# Altium schematic sheet Sheet1.SchDoc
size A4
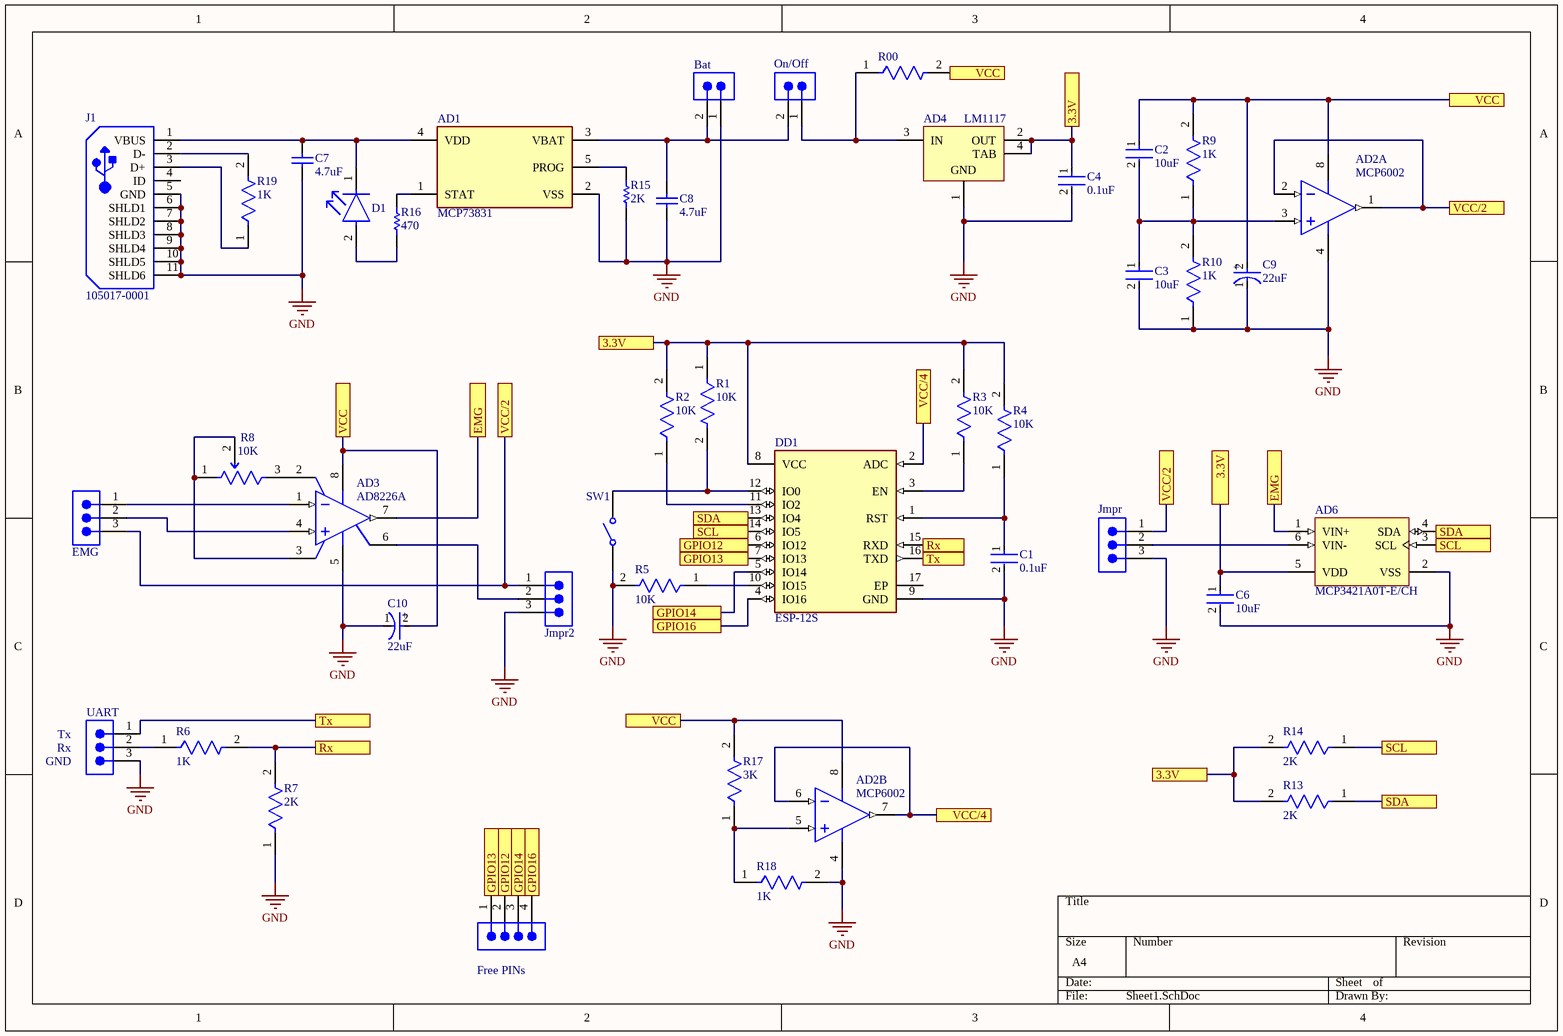
[diagram p0: Sheet1.SchDoc]

## Parts
AD1  MCP73831  [FP-C04-091-OT-IPC_B]
AD2  MCP6002  [SOIC-SN8_M]  (parts A,B of 2)
AD3  AD8226A  [ADI-RM-8_L]
AD4  LM1117  [DCY0004A_L]
AD6  MCP3421A0T-E/CH  [SOT-23-CH6_M]
Bat  TSW-102-26-G-S  [SMTC-TSW-102-26-XX-S]  (value not drawn)
C1  0.1uF  [FP-0805-L_2_0_0_1-W_1_25-IPC_C]
C2  10uF  [FP-0805-L_2_0_0_1-W_1_25-IPC_C]
C3  10uF  [FP-0805-L_2_0_0_1-W_1_25-IPC_C]
C4  0.1uF  [FP-0805-L_2_0_0_1-W_1_25-IPC_C]
C6  10uF  [FP-0805-L_2_0_0_1-W_1_25-IPC_C]
C7  4.7uF  [CAPC2013X145X50LL20T20]
C8  4.7uF  [CAPC2013X145X50LL20T20]
C9  22uF  [FP-NLJP-MFG]
C10  22uF  [FP-NLJP-MFG]
D1  LTST-C190GKT  [FP-LTST-C190GKT-MFG]  (value not drawn)
DD1  ESP-12S  [FP-ESP-12S-MFG]
EMG  TSW-103-07-T-S  [SMTC-TSW-103-07-X-S]  (value not drawn)
Free_PINs  TSW-104-08-L-S  [SMTC-TSW-104-08-X-S]  (value not drawn)
J1  105017-0001  [USB-MICRO-B_V]
Jmpr  TSW-103-07-T-S  [SMTC-TSW-103-07-X-S]  (value not drawn)
Jmpr2  TSW-103-07-T-S  [SMTC-TSW-103-07-X-S]  (value not drawn)
On/Off  TSW-102-26-G-S  [SMTC-TSW-102-26-XX-S]  (value not drawn)
R00  RP73D2B10RBTG  [FP-RP732B-MFG]  (value not drawn)
R1  10K  [FP-RG2012-IPC_C]
R2  10K  [FP-RG2012-IPC_C]
R3  10K  [FP-RG2012-IPC_C]
R4  10K  [FP-RG2012-IPC_C]
R5  10K  [FP-RG2012-IPC_C]
R6  1K  [FP-RG2012-IPC_C]
R7  2K  [FP-RG2012-IPC_C]
R8  10K  [FP-TC33X-2-MFG]
R9  1K  [FP-RG2012-IPC_C]
R10  1K  [FP-RG2012-IPC_C]
R13  2K  [FP-RG2012-IPC_C]
R14  2K  [FP-RG2012-IPC_C]
R15  2K  [RESC2013X60X30ML20T20]
R16  470  [RESC2013X60X30ML20T20]
R17  3K  [FP-RG2012-IPC_C]
R18  1K  [FP-RG2012-IPC_C]
R19  1K  [FP-RG2012-IPC_C]
SW1  434111050826  [434111050826]  (value not drawn)
UART  TSW-103-07-T-S  [SMTC-TSW-103-07-X-S]  (value not drawn)

## Ports
3.3V, EMG, GPIO12, GPIO13, GPIO14, GPIO16, Rx, SCL, SDA, Tx, VCC, VCC/2, VCC/4

## Nets
GND: AD1.2(VSS) AD2.4(VSS) AD3.5(-VS) AD4.1(GND) AD6.2(VSS) Bat.1 C1.2 C3.2 C4.2 C6.2 C7.1 C8.1 C9.1(C) C10.1(C) DD1.9(GND) J1.5(GND) J1.6(SHLD1) J1.7(SHLD2) J1.8(SHLD3) J1.9(SHLD4) J1.10(SHLD5) J1.11(SHLD6) Jmpr.3 Jmpr2.3 R5.2 R7.1 R10.1 R15.1 R18.2 SW1.1 UART.3
3.3V: AD4.2(OUT) AD4.4(TAB) AD6.5(VDD) C4.1 C6.1 DD1.8(VCC) R1.1 R2.2 R3.2 R4.2 R13.2 R14.2 ; port 3.3V
EMG: AD3.7(VOUT) AD6.1(VIN+) ; port EMG
GPIO12: DD1.6(IO12) Free_PINs.2 ; port GPIO12
GPIO13: DD1.7(IO13) Free_PINs.1 ; port GPIO13
GPIO14: DD1.5(IO14) Free_PINs.3 ; port GPIO14
GPIO16: DD1.4(IO16) Free_PINs.4 ; port GPIO16
Rx: DD1.15(RXD) R6.2 R7.2 ; port Rx
SCL: AD6.3(SCL) DD1.14(IO5) R14.1 ; port SCL
SDA: AD6.4(SDA) DD1.13(IO4) R13.1 ; port SDA
Tx: DD1.16(TXD) UART.1 ; port Tx
VCC: AD2.8(VDD) AD3.8(+VS) C2.1 C9.2(A) C10.2(A) R00.2 R9.2 R17.2 ; port VCC
VCC/2: AD2.1(VOUTA) AD2.2(VINA-) EMG.3 Jmpr.1 Jmpr2.1 ; port VCC/2
VCC/4: AD2.6(VINB-) AD2.7(VOUTB) DD1.2(ADC) ; port VCC/4
NetAD1_1: AD1.1(STAT) R16.2
NetAD1_3: AD1.3(VBAT) Bat.2 C8.2 On/Off.2
NetAD1_4: AD1.4(VDD) C7.2 D1.1(C) J1.1(VBUS)
NetAD1_5: AD1.5(PROG) R15.2
NetAD2_3: AD2.3(VINA+) C2.2 C3.1 R9.1 R10.2
NetAD2_5: AD2.5(VINB+) R17.1 R18.1
NetAD3_1: AD3.1(-IN) EMG.1
NetAD3_2: AD3.2(RG) R8.3(CW)
NetAD3_3: AD3.3(RG) R8.1(CCW) R8.2(WIPER)
NetAD3_4: AD3.4(+IN) EMG.2
NetAD3_6: AD3.6(REF) Jmpr2.2
NetAD4_3: AD4.3(IN) On/Off.1 R00.1
NetAD6_6: AD6.6(VIN-) Jmpr.2
NetC1_1: C1.1 DD1.1(RST) R4.1
NetD1_2: D1.2(A) R16.1
NetDD1_3: DD1.3(EN) R3.1
NetDD1_10: DD1.10(IO15) R5.1
NetDD1_11: DD1.11(IO2) R2.1
NetDD1_12: DD1.12(IO0) R1.2 SW1.2
NetJ1_2: J1.2(D-) R19.2
NetJ1_3: J1.3(D+) R19.1
NetR6_1: R6.1 UART.2

Not connected (* = marked no-connect by the designer): DD1 17(EP); J1 4(ID)

## Notes on the sheet
- (near UART) GND
- (near UART) Rx
- (near UART) Tx
- (in symbol CMP-04425-000003-1) +

## Library data of the parts
AD1 = CMP-0133-00143-2: IC CONTROLLR LI-ION 4.2V SOT23-5; Max Power Dissipation: 1.54W; Output Current: 500mA; Max Output Voltage: 4.5V; Number of Outputs: 1; Min Output Voltage: 4.168V; Min Supply Voltage: 3.75V; Max Input Voltage: 6V; Voltage Rating: 4.534V; Drain to Source Resistance: 350mR; Max Operating Temperature: 85°C; Length: 0.122inch; Number of Pins: 5; REACH SVHC: No SVHC; Radiation Hardening: No; Min Operating Temperature: -40°C; Weight: 0.00709oz; Contact Plating: Tin; Termination: SMD/SMT; Case/Package: SOT-23; Mount: Surface Mount; Width: 0.071inch; Packaging: Tape and Reel; Number of Cells: 1; Max Charge Current: 500mA; Height: 0.051inch; Number of Channels: 1; Output Voltage: 4.2V; Max Supply Voltage: 6V; Lead Free: Lead Free
AD2 = CMP-0187-00365-3: None; Bandwidth: 1MHz; Number of Elements: 2; Power Supply Rejection Ratio (PSRR): 86dB; Nominal Supply Current: 100uA; Max Supply Voltage: 6V; Input Offset Voltage-Max: 4.5mV; Voltage Gain: 112dB; Input Bias Current: 1pA; Min Supply Voltage: 1.8V; Slew Rate: 0.6V/µs; Operating Supply Voltage: 5.5V; Amplifier Type: GENERAL PURPOSE; Output Current: 23mA; Common Mode Rejection Ratio: 60dB; Gain Bandwidth Product: 1MHz; Min Operating Temperature: -40°C; Supply Current: 100uA; Number of Circuits: 2; Package Quantity: 100; Width: 3.9mm; Technology: CMOS; RoHS Compliant: Yes; Radiation Hardening: No; Mount: Surface Mount; Number of Pins: 8; Length: 4.9mm; Case/Package: SOIC; Number of Channels: 2; Max Operating Temperature: 85°C; Unity Gain Bandwidth Product: 1MHz; Lead Free: Lead Free; Number of Amplifiers: 2; REACH SVHC: No SVHC; Slew Rate-Nom: 0.6V/µs; Height: 1.25mm; Input Offset Voltage (Vos): 4.5mV; Packaging: Rail/Tube
AD3 = CMP-2000-05748-1: Wide Supply Range, Rail-to-Rail Output Instrumentation Amplifier, 2.2 to 36 V, -40 to 125 degC, 8-Pin MSOP (RM-8), RoHS, Tube; Manufacturer: Analog Devices; Current - Input Bias: 20nA; -3db Bandwidth: 1.5MHz; Product Training Modules: CommonPhotodiodeOp-AmpCircuitProblemsandSolutionsIndirectCurrentFeedbackInstrumentationAmplifierApplicationsGuide; Slew Rate: 0.6V/µs; Voltage - Supply, Single/Dual (±): 2.2V~36V,±1.35V~18V; PCN Design/Specification: PolyimideAlignmentTarget11/Aug/2015; EDA / CAD Models: DownloadfromAcceleratedDesigns; Number of Circuits: 1; Current - Supply: 350µA; Package Version: 10/2009; Current - Output / Channel: 13mA; Design Resources: PLCandDCSUniversalAnalogInputUsingEither4or6-PinTerminalBlock; Voltage - Input Offset: 100µV; Mfg Application Notes: AutomaticExternalDefibrillator(AED)SolutionsElectromagneticFlowMeterSolutionsMotorControlSolution—ServoControlProgrammableLogicControllers(PLCs)SolutionsElectrocardiogram(ECG)Solutions; Gain Bandwidth Product: -; Amplifier Type: Instrumentation; Family: Linear-Amplifiers-Instrumentation,OPAmps,BufferAmps; Category: IntegratedCircuits(ICs); Online Catalog: Instrumentation; Package Description: 8-Pin Mini Small Outline Package, Body 3 x 3 mm, Pitch 0.65 mm; Datasheet URL: http://www.analog.com/media/en/technical-documentation/data-sheets/AD8226.pdf; Package / Case: 8-TSSOP,8-MSOP(0.118",3.00mmWidth); Datasheet Version: Rev. C, 09/2012; Mounting Type: SurfaceMount; Standard Package: 50; Mounting Technology: SurfaceMount; Package Reference: RM-8; Manufacturer URL: http://www.analog.com/; Supplier Device Package: 8-MSOP; Package URL: http://www.analog.com/static/imported-files/packages/PKG_PDF/MSOP%28RM%29/RM_8.pdf; Packaging: Tube; Operating Temperature: -40°C~125°C; Series: -; Output Type: Rail-to-Rail
AD4 = CMP-0062-01639-4: 800mA Low-Dropout Linear Regulator, 4-pin SOT-223, Pb-Free; PartNumber: LM1117MPX-3.3/NOPB; Manufacturer: Texas Instruments; High-Reliability: Y; PowerWise: N; PackageTopMarking: XYTT*N05A; CompType: LDO IC; ComponentLink1URL: http://www.ti.com/general/docs/lit/getliterature.tsp?genericPartNumber=LM1117-N&fileType=pdf; ComponentLink1Description: Datasheet URL; PinCount: 4; Code_JEDEC: TO-261-AA; PackageDescription: Molded SOT-223, 6.50 x 3.56 x 1.6mm Body, 4 Lead, 2.3mm Pitch; PackageReference: DCY0004A; RoHS: Y; Code_IPC: SOT223-4
AD6 = CMP-0188-00739-2: 18-Bit Analog-to-Digital Converter with I2C Interface and On-Board Reference, 6-Pin SOT-23, Extended Temperature, Tape and Reel; ComponentLink1URL: http://www.microchip.com/; ComponentLink2URL: http://ww1.microchip.com/downloads/en/DeviceDoc/22003e.pdf; ComponentLink1Description: Manufacturer URL; ComponentLink2Description: Datasheet; PackageVersion: revBB, Aug-2009; ComponentLink3URL: http://www.microchip.com/stellent/groups/techpub_sg/documents/packagingspec/en012702.pdf; RevisionNote: URLs added.; DatasheetVersion: revE, Aug-2009; PackageReference: SOT-23-CH6; Code_IPC: SOT26A-6; PackageDescription: 6-Lead Plastic Small Outline Transistor (CH) [SOT-23]; ComponentLink3Description: Package Specification
Bat On/Off = CMP-1024-00327-1: 0.025" SQ Post Header, Through-hole, Vertical, -55 to 125 degC, 2.54 mm Pitch, 2-Pin, Male, RoHS; Manufacturer: Samtec; Pitch: 2.54 mm; Orientation: Vertical; ComponentLink3Description: Package Specification; PackageReference: TSW-102-26-XX-S; Mounting Technology: Through-hole; ComponentLink2Description: Datasheet; ComponentLink1URL: http://www.samtec.com; DatasheetVersion: F-214; ComponentLink1Description: Manufacturer URL; RoHS: True; ComponentLink2URL: http://www.samtec.com/documents/webfiles/pdf/TSW_TH.PDF; PartNumber: TSW-102-26-G-S; ComponentLink3URL: http://www.samtec.com/documents/webfiles/cpdf/TSW-XXX-XX-XXX-X-XX-XXX-MKT.pdf; PackageDescription: .025[0.64] SQ. Post Terminal Strip Assembly; PackageVersion: DM, 8/1988; Temperature Range: -55 to 125 degC
C1-C4 C6 = CMP-14477-004636-2: Multilayer Ceramic Capacitor 0.1 uF 10V 10% SMD 0805 T/R; Capacitance: 100nF; Thickness: 0.053inch; Lead Free: Lead Free; Halogen Free: Halogen Free; Tolerance: 10%; Min Operating Temperature: -55°C; Package Quantity: 3000; Construction: Flat; Case/Package: 0805; Voltage: 10V; Max Operating Temperature: 125°C; Width: 1.25mm; Voltage Rating (DC): 10V; Series: CFCAP™; Number of Pins: 2; Case Code (Metric): 2012; Length: 2mm; Resistor Type: Ceramic; Termination: SMD/SMT; Case Code (Imperial): 0805; Height: 1.25mm; Packaging: Tape and Reel; RoHS Compliant: Yes; Voltage Rating: 10V; Weight: 0.000194oz; Mount: Surface Mount; Depth: 1.25mm; Radiation Hardening: No
C7 C8 = CMP-2007-01344-1: Part Number: VJ0805A472FXJTW1BC; Manufacturer: Vitramon
C9 C10 = CMP-04425-000003-1: CAP NIOB OXIDE 22UF 20% 4V 0805; Manufacturer: AVX Corporation; Manufacturer Part Number: NLJP226M004R4000; Esr: 4000mΩ; Life: 1000Hours; Leakage Current: 8.8uA; Ripple Current: 134mA; Material: Niobium Oxide; Temperature Coefficient: +25/-20%; Octopart: https://octopart.com/nljp226m004r4000-avx-10566975; Device Class L2: Capacitors; ComponentLink2URL: http://datasheets.avx.com/NLJ.pdf; Device Class L1: Passive Components; ComponentLink2Description: Datasheet; Mouser Description: Niobium Oxide Capacitors 4volts 22uF 20% ESR=4000mOhms; Package: NLJP; Capacitance: 22uF; Category: Cap; Value: 22uF; Footprint Url: https://www.avx.com/download/software/literature/AVX-Footprint-Library.pdf; Lead Free: Yes; RoHS: TRUE; Voltage Rating: 4V; Digikey Description: CAP NIOB OXIDE 22UF 20% 4V 0805; Device Class L3: Niobium Oxide; Automotive: No; Temperature Range High: +105°C; Height: 1.5mm; Temperature Range Low: -55°C; Temperature: -55°C to +105°C; Tolerance: 20%
D1 = CMP-22017-000005-2: LED GREEN CLEAR CHIP SMD; Dominant Wavelength: 569nm; Reverse Voltage: 5V; Lens Color: Colorless; Viewing Angle: 130°; Voltage: 2V; Forward Current: 30mA; Power Dissipation: 100mW; Luminous Intensity: 6mcd; Number of LEDs: 1; Forward Voltage: 2.1V; Wavelength: 565nm; Test Current: 10mA; Min Operating Temperature: -55°C; Lens Style: Clear; Mount: Surface Mount; Width: 0.8mm; Packaging: Tape and Reel; Lens Transparency: Clear; Case Code (Metric): 1608; Depth: 0.8mm; Case Code (Imperial): 0603; Case/Package: 0603; Number of Pins: 2; Max Operating Temperature: 85°C; Lead Free: Lead Free; Number of Elements: 1; Length: 1.6mm; Height: 0.8mm; Package Quantity: 1; Power Rating: 100mW; Radiation Hardening: No; Illumination Color: Green; Color: Green
DD1 = CMP-204316-000002-1: RX TXRX MOD WIFI PCB TRACE SMD; Interface: I2C; Sensitivity: -90dBm; Data Rate: 54Mbps; Frequency: 2.484GHz; Series: -
EMG Jmpr Jmpr2 UART = CMP-1024-00332-1: 0.025" SQ Post Header, Through-hole, Vertical, -55 to 105 degC, 2.54 mm Pitch, 3-Pin, Male, RoHS; Manufacturer: Samtec; Pitch: 2.54 mm; ComponentLink1URL: http://www.samtec.com; ComponentLink3URL: http://www.samtec.com/documents/webfiles/cpdf/TSW-XXX-XX-XXX-X-XX-XXX-MKT.pdf; PartNumber: TSW-103-07-T-S; Mounting Technology: Through-hole; RoHS: True; DatasheetVersion: F-214; PackageVersion: DM, 8/1988; Temperature Range: -55 to 105 degC; ComponentLink2Description: Datasheet; ComponentLink1Description: Manufacturer URL; Orientation: Vertical; PackageReference: TSW-103-07-X-S; ComponentLink3Description: Package Specification; ComponentLink2URL: http://www.samtec.com/documents/webfiles/pdf/TSW_TH.PDF; PackageDescription: .025[0.64] SQ. Post Terminal Strip Assembly
Free_PINs = CMP-1024-00358-1: 0.025" SQ Post Header, Through-hole, Vertical, -55 to 125 degC, 2.54 mm Pitch, 4-Pin, Male, RoHS; Manufacturer: Samtec; Pitch: 2.54 mm; PartNumber: TSW-104-08-L-S; RoHS: True; Temperature Range: -55 to 125 degC; PackageDescription: .025[0.64] SQ. Post Terminal Strip Assembly; Orientation: Vertical; ComponentLink2URL: http://www.samtec.com/documents/webfiles/pdf/TSW_TH.PDF; ComponentLink1Description: Manufacturer URL; ComponentLink2Description: Datasheet; PackageVersion: DM, 8/1988; ComponentLink3URL: http://www.samtec.com/documents/webfiles/cpdf/TSW-XXX-XX-XXX-X-XX-XXX-MKT.pdf; Mounting Technology: Through-hole; PackageReference: TSW-104-08-X-S; ComponentLink3Description: Package Specification; ComponentLink1URL: http://www.samtec.com; DatasheetVersion: F-214
J1 = CMP-2000-05827-1: Micro-USB B Receptacle, Right Angle, Bottom Mount, Surface Mount, with Solder Tabs, -30 to 85 degC, 5-Pin USB, RoHS, Tape and Reel; Manufacturer: Molex; Featured Product: Micro-USBConnectorsUSBConnectors; Other Names: WM1399DKR; Package Version: Rev. F, 12/2012; Number of Contacts: 5; Connector Type: USB-microB; Catalog Drawings: 1050170001; 3D Model: 105017-0001.stp; Mating Products: WM17145-ND-CABLEMICROUSBBTOSTDA1.0MWM17147-ND-CABLEMICROUSBBTOSTDA2.0MWM17146-ND-CABLEMICROUSBBTOSTDA1.5M; PCN Assembly/Origin: ResinSupplier21/Oct/2015; Voltage - Max: 30V; Online Catalog: Molex-MicroUSB; Manufacturer URL: http://www.molex.com/; Package Description: 5-Leads USB, Micro B, Body 7.5 x 5 mm, Pitch 0.65 mm; Datasheet URL: http://www.molex.com/elqNow/elqRedir.htm?ref=http://www.molex.com/webdocs/datasheets/pdf/en-us/1050170001_IO_CONNECTORS.pdf; Ingress Protection: -; Datasheet Version: 03/2016; Mounting Type: BoardCutout,SurfaceMount,RightAngle; Circuits: 5; Standard Package: 1; Package Reference: MICRO-B; Package URL: http://www.molex.com/pdm_docs/sd/1050170001_sd.pdf; Category: Connectors,Interconnects; Series: -; RoHS Information: 1050170001CertofCompliance; Features: Shielded,SolderRetention; Family: USB,DVI,HDMIConnectors; Specifications: -; Gender: Receptacle; Packaging: Digi-Reel®; Mounting Technology: SurfaceMount
R00 = CMP-03211-009864-1: Res Thin Film 1206 10Ω 0.1% 0.25W 15ppm/°C Molded SMD; Manufacturer: TE Connectivity; Voltage Rating: 200V; Power Rating: 0.25W; Octopart: https://octopart.com/rp73d2b10rbtg-te+connectivity-42012237; Series: RP73; Height: 0.65mm; Package: RP732B; Temperature Range High: 155°C; Device Class L3: Chip SMD Resistors; Automotive: No; ComponentLink2URL: https://www.te.com/commerce/DocumentDelivery/DDEController?Action=showdoc&DocId=Data+Sheet%7F1773272%7FL%7Fpdf%7FEnglish%7FENG_DS_1773272_L.pdf%7F8-1879255-6; Value: 10Ω; ComponentLink2Description: Datasheet; Tolerance: 0.1%; Manufacturer Part Number: RP73D2B10RBTG; Resistance: 10Ω; Temperature: -55°C to 155°C; Category: Res; packaging: 250 cut tape length; Device Class L2: Resistors; Device Class L1: Passive Components; RoHS: TRUE; Temperature Coefficient: 15ppm/°C; Lead Free: Yes; Composition: Thin Film; Ipc Land Pattern Name: RESC305155X55; octopart_url: https://octopart.com/rp73d2b10rbtg-te+connectivity-42012237; Temperature Range Low: -55°C
R1-R7 R9 R10 R13 R14 R17-R19 = CMP-2001-04803-2: Automotive Metal Thin Film Chip Resistor, 0805, 10kΩ, 0.05%, 10ppm/°C, 0.125W, 150V; Resistance: 10kR; Max Power Dissipation: 125mW; RoHS Compliant: Yes; Temperature Coefficient: 10ppm/°C; Lead Free: Lead Free; Packaging: Tape and Reel; Package Quantity: 5000; Power Rating: 125mW; Case Code (Metric): 2012; Min Operating Temperature: -55°C; Height: 0.02inch; Voltage Rating: 150V; Tolerance: 0.05%; Case Code (Imperial): 0805; Termination: SMD/SMT; Width: 1.2mm; Series: RG; Resistor Type: Thin Film; Size Code: 0805; Max Operating Temperature: 155°C; Features: Automotive AEC-Q200; Weight: 0.000194oz; Case/Package: 0805; Voltage Rating (DC): 150V; Number of Terminations: 2; Length: 0.079inch
R8 = CMP-07234-000040-1: TRIMMER 100K OHM 0.1W J LEAD TOP; Number of Turns: 1; Voltage Rating (DC): 50V; Power Rating: 100mW; Resistance Tolerance: 25%; Resistance: 100kR; Temperature Coefficient: 250ppm/°C; Max Operating Temperature: 100°C; Package Quantity: 2500; REACH SVHC: No SVHC; Termination: Foot Print; Packaging: Tape and Reel; RoHS Compliant: Yes; Military Standard: Not; Color: Silver; Width: 0.118inch; Min Operating Temperature: -40°C; Mount: Surface Mount; Height: 0.047inch; Tolerance: 25%; Resistor Type: Carbon; Length: 3mm; Depth: 3.8mm; Weight: 29.4mg; Max Power Dissipation: 100mW; Series: TC33; Radiation Hardening: No
R15 R16 = CMP-2001-04656-1: Part Number: RK73B2ATTD102J; Manufacturer: KOA Speer
SW1 = CMP-1459-00003-1: WS-TASV SMD Tact Switch 6.0X3.5 mm; Manufacturer: Wuerth Elektronik; NoPins: 02; ComponentLink2URL: http://katalog.we-online.de/em/datasheet/434111050826.pdf; PackageReference: 434111050826; ComponentLink2Description: Datasheet; PartNumber: 434111050826; ComponentLink1URL: http://www.we-online.com; ComponentLink1Description: Manufacturer URL